# EAGLE schematic pimc (EAGLE 6.5.0)
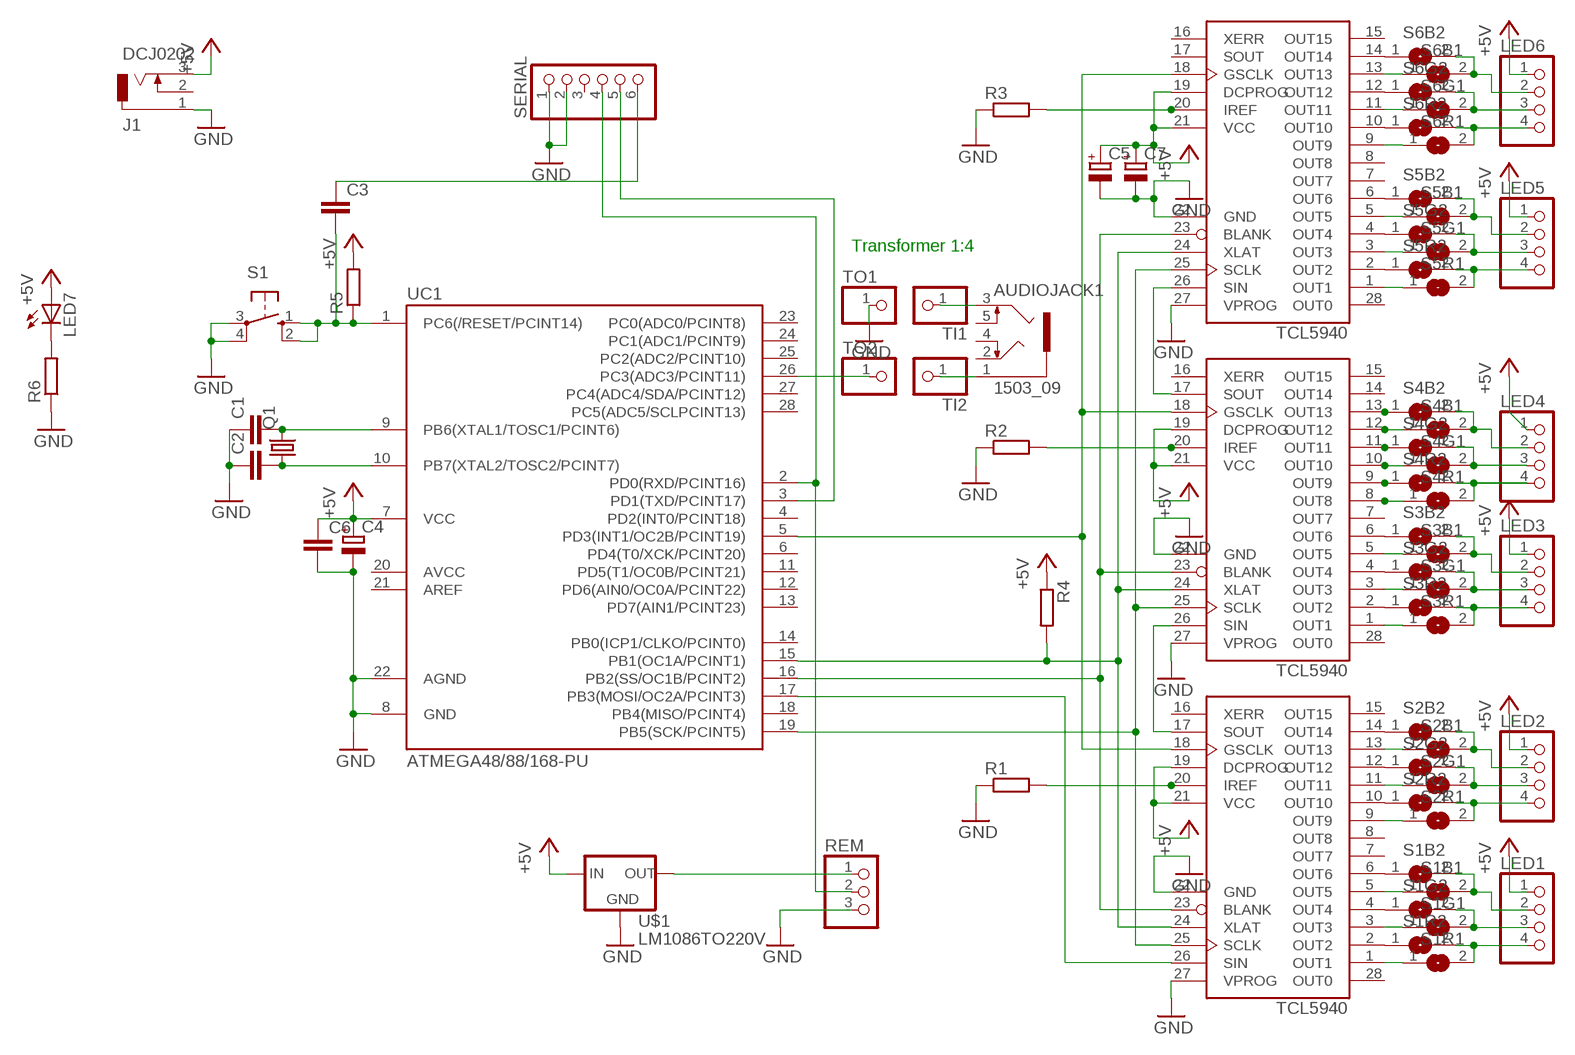
[diagram p0: schematic, sheet 1]

## Parts
AUDIOJACK1  1503_09  [1503_09]
C1  C-EU025-025X050  [C025-025X050]
C2  C-EU025-025X050  [C025-025X050]
C3  C-EU025-025X050  [C025-025X050]
C4  CPOL-EUE3.5-8  [E3,5-8]
C5  CPOL-EUE3.5-8  [E3,5-8]
C6  C-EU025-025X050  [C025-025X050]
C7  CPOL-EUE3.5-8  [E3,5-8]
DRV1  TCL5940  [DIP28]
DRV2  TCL5940  [DIP28]
DRV3  TCL5940  [DIP28]
J1  DCJ0202  [DCJ0202]
LED1  PINHD-1X4  [1X04]
LED2  PINHD-1X4  [1X04]
LED3  PINHD-1X4  [1X04]
LED4  PINHD-1X4  [1X04]
LED5  PINHD-1X4  [1X04]
LED6  PINHD-1X4  [1X04]
LED7  LED5MM  [LED5MM]
Q1  CRYSTALHC49S  [HC49/S]
R1  R-EU_0204/7  [0204/7]
R2  R-EU_0204/7  [0204/7]
R3  R-EU_0204/7  [0204/7]
R4  R-EU_0204/7  [0204/7]
R5  R-EU_0204/7  [0204/7]
R6  R-EU_0204/7  [0204/7]
REM  PINHD-1X3  [1X03]
S1  10-XX  [B3F-10XX]
S1B1  SJ  [SJ]
S1B2  SJ  [SJ]
S1G1  SJ  [SJ]
S1G2  SJ  [SJ]
S1R1  SJ  [SJ]
S1R2  SJ  [SJ]
S2B1  SJ  [SJ]
S2B2  SJ  [SJ]
S2G1  SJ  [SJ]
S2G2  SJ  [SJ]
S2R1  SJ  [SJ]
S2R2  SJ  [SJ]
S3B1  SJ  [SJ]
S3B2  SJ  [SJ]
S3G1  SJ  [SJ]
S3G2  SJ  [SJ]
S3R1  SJ  [SJ]
S3R2  SJ  [SJ]
S4B1  SJ  [SJ]
S4B2  SJ  [SJ]
S4G1  SJ  [SJ]
S4G2  SJ  [SJ]
S4R1  SJ  [SJ]
S4R2  SJ  [SJ]
S5B1  SJ  [SJ]
S5B2  SJ  [SJ]
S5G1  SJ  [SJ]
S5G2  SJ  [SJ]
S5R1  SJ  [SJ]
S5R2  SJ  [SJ]
S6B1  SJ  [SJ]
S6B2  SJ  [SJ]
S6G1  SJ  [SJ]
S6G2  SJ  [SJ]
S6R1  SJ  [SJ]
S6R2  SJ  [SJ]
SERIAL  PINHD-1X6  [1X06]
TI1  PINHD-1X1  [1X01]
TI2  PINHD-1X1  [1X01]
TO1  PINHD-1X1  [1X01]
TO2  PINHD-1X1  [1X01]
U$1  LM1086TO220V  [TO220S]
UC1  ATMEGA48/88/168-PU  [DIL28-3]

## Nets
+5V: C4.+ C5.+ C6.1 C7.+ DRV1.19(DCPROG) DRV1.21(VCC) DRV2.19(DCPROG) DRV2.21(VCC) DRV3.19(DCPROG) DRV3.21(VCC) J1.3 LED1.1 LED2.1 LED3.1 LED4.1 LED5.1 LED6.1 LED7.A R4.1 R5.2 U$1.3(IN) UC1.7(VCC)
GND: C1.1 C2.1 C4.- C5.- C6.2 C7.- DRV1.22(GND) DRV1.27(VPROG) DRV2.22(GND) DRV2.27(VPROG) DRV3.22(GND) DRV3.27(VPROG) J1.1 R1.1 R2.1 R3.1 R6.1 REM.3 S1.3(P) S1.4(P1) SERIAL.1 SERIAL.2 TO1.1 U$1.1(GND) UC1.8(GND) UC1.22(AGND)
N$1: DRV1.14(OUT14) S2B2.1
N$2: DRV1.12(OUT12) S2G2.1
N$3: DRV1.10(OUT10) S2R2.1
N$4: DRV1.2(OUT2) S1R2.1
N$5: DRV1.4(OUT4) S1G2.1
N$6: DRV1.6(OUT6) S1B2.1
N$7: DRV1.13(OUT13) S2B1.1
N$8: DRV1.11(OUT11) S2G1.1
N$9: DRV1.9(OUT9) S2R1.1
N$10: DRV1.5(OUT5) S1B1.1
N$11: DRV1.3(OUT3) S1G1.1
N$12: DRV1.1(OUT1) S1R1.1
N$13: LED2.2 S2B1.2 S2B2.2
N$14: LED2.3 S2G1.2 S2G2.2
N$15: LED2.4 S2R1.2 S2R2.2
N$16: LED1.2 S1B1.2 S1B2.2
N$17: LED1.3 S1G1.2 S1G2.2
N$18: LED1.4 S1R1.2 S1R2.2
N$19: DRV2.8(OUT8) S4R1.1
N$20: DRV2.10(OUT10) S4G1.1
N$21: DRV2.12(OUT12) S4B1.1
N$22: DRV2.5(OUT5) S3B1.1
N$23: DRV2.3(OUT3) S3G1.1
N$24: DRV2.1(OUT1) S3R1.1
N$25: LED4.4 S4R1.2 S4R2.2
N$26: LED4.3 S4G1.2 S4G2.2
N$27: LED4.2 S4B1.2 S4B2.2
N$28: LED3.2 S3B1.2 S3B2.2
N$29: LED3.3 S3G1.2 S3G2.2
N$30: LED3.4 S3R1.2 S3R2.2
N$31: DRV2.9(OUT9) S4R2.1
N$32: DRV2.11(OUT11) S4G2.1
N$33: DRV2.13(OUT13) S4B2.1
N$34: DRV2.2(OUT2) S3R2.1
N$35: DRV2.4(OUT4) S3G2.1
N$36: DRV2.6(OUT6) S3B2.1
N$37: DRV3.13(OUT13) S6B1.1
N$38: DRV3.11(OUT11) S6G1.1
N$39: DRV3.9(OUT9) S6R1.1
N$40: DRV3.5(OUT5) S5B1.1
N$41: DRV3.3(OUT3) S5G1.1
N$42: DRV3.1(OUT1) S5R1.1
N$43: LED6.2 S6B1.2 S6B2.2
N$44: LED6.3 S6G1.2 S6G2.2
N$45: LED6.4 S6R1.2 S6R2.2
N$46: LED5.2 S5B1.2 S5B2.2
N$47: LED5.3 S5G1.2 S5G2.2
N$48: LED5.4 S5R1.2 S5R2.2
N$49: DRV3.14(OUT14) S6B2.1
N$50: DRV3.12(OUT12) S6G2.1
N$51: DRV3.10(OUT10) S6R2.1
N$52: DRV3.2(OUT2) S5R2.1
N$53: DRV3.4(OUT4) S5G2.1
N$54: DRV3.6(OUT6) S5B2.1
N$55: DRV1.17(SOUT) DRV2.26(SIN)
N$56: DRV2.17(SOUT) DRV3.26(SIN)
N$57: DRV1.26(SIN) UC1.17(PB3(MOSI/OC2A/PCINT3))
N$58: DRV1.25(SCLK) DRV2.25(SCLK) DRV3.25(SCLK) UC1.19(PB5(SCK/PCINT5))
N$59: DRV1.24(XLAT) DRV2.24(XLAT) DRV3.24(XLAT) R4.2 UC1.15(PB1(OC1A/PCINT1))
N$60: DRV1.23(BLANK) DRV2.23(BLANK) DRV3.23(BLANK) UC1.16(PB2(SS/OC1B/PCINT2))
N$61: DRV3.20(IREF) R3.2
N$62: DRV2.20(IREF) R2.2
N$63: DRV1.20(IREF) R1.2
N$64: DRV1.18(GSCLK) DRV2.18(GSCLK) DRV3.18(GSCLK) UC1.5(PD3(INT1/OC2B/PCINT19))
N$65: C1.2 Q1.2 UC1.9(PB6(XTAL1/TOSC1/PCINT6))
N$66: C2.2 Q1.1 UC1.10(PB7(XTAL2/TOSC2/PCINT7))
N$67: AUDIOJACK1.1 TI2.1
N$68: AUDIOJACK1.3 TI1.1
N$69: LED7.K(C) R6.2
N$70: REM.2 SERIAL.4 UC1.2(PD0(RXD/PCINT16))
N$71: SERIAL.5 UC1.3(PD1(TXD/PCINT17))
N$72: C3.2 R5.1 S1.1(S) S1.2(S1) UC1.1(PC6(/RESET/PCINT14))
N$73: C3.1 SERIAL.6
N$74: REM.1 U$1.2(OUT)
N$75: TO2.1 UC1.26(PC3(ADC3/PCINT11))
Unconnected: AUDIOJACK1.2 AUDIOJACK1.4 AUDIOJACK1.5 DRV1.7(OUT7) DRV1.8(OUT8) DRV1.15(OUT15) DRV1.16(XERR) DRV1.28(OUT0) DRV2.7(OUT7) DRV2.14(OUT14) DRV2.15(OUT15) DRV2.16(XERR) DRV2.28(OUT0) DRV3.7(OUT7) DRV3.8(OUT8) DRV3.15(OUT15) DRV3.16(XERR) DRV3.17(SOUT) DRV3.28(OUT0) J1.2 SERIAL.3 UC1.4(PD2(INT0/PCINT18)) UC1.6(PD4(T0/XCK/PCINT20)) UC1.11(PD5(T1/OC0B/PCINT21)) UC1.12(PD6(AIN0/OC0A/PCINT22)) UC1.13(PD7(AIN1/PCINT23)) UC1.14(PB0(ICP1/CLKO/PCINT0)) UC1.18(PB4(MISO/PCINT4)) UC1.20(AVCC) UC1.21(AREF) UC1.23(PC0(ADC0/PCINT8)) UC1.24(PC1(ADC1/PCINT9)) UC1.25(PC2(ADC2/PCINT10)) UC1.27(PC4(ADC4/SDA/PCINT12)) UC1.28(PC5(ADC5/SCLPCINT13))

## Notes on the sheet
- Transformer 1:4

## Library data of the parts
AUDIOJACK1 = con-lumberg:1503_09: Jack connectors according to JISC 6560, 3.5 mm Klinkeneinbaukupplung nach JISC 6560, 3,5 mm, 3-polig/ stereo, abgewinkelte Ausführung, mit 2 Öffnern und Lötaugen, für Leiterplatten Rückseitenmontage Source: http://www.lumberg.com/Produkte/PDFs/1503_09.pdf; OC_FARNELL: 1243244; OC_NEWARK: unknown
C1-C3 C6 = rcl:C-EU: CAPACITOR, European symbol
C4 C5 C7 = rcl:CPOL-EU: POLARIZED CAPACITOR, European symbol
DRV1-DRV3 = tcl5940:TCL5940: 16-Channel 12-Bit LED Driver
J1 = con-jack:DCJ0202: DC POWER JACK Source: DCJ0202.pdf; OC_FARNELL: unknown; OC_NEWARK: unknown
LED1-LED6 = pinhead:PINHD-1X4: PIN HEADER
LED7 = led:LED: LED OSRAM: - CHIPLED LG R971, LG N971, LY N971, LG Q971, LY Q971, LO R971, LY R971 LH N974, LH R974 LS Q976, LO Q976, LY Q976 LO Q996 - Hyper CHIPLED LW Q18S LB Q993, LB Q99A, LB R99A - SideLED LS A670, LO A670, LY A670, LG A670, LP A670 LB A673, LV A673, LT A673, LW A673 LH A674 LY A675 LS A676, LA A676, LO A676, LY A676, LW A676 LS A679, LY A679, LG A679 - Hyper Micro SIDELED® LS Y876, LA Y876, LO Y876, LY Y876 LT Y87S - SmartLED LW L88C, LW L88S LB L89C, LB L89S, LG L890 LS L89K, LO L89K, LY L89K LS L896, LA L896, LO L896, LY L896 - TOPLED LS T670, LO T670, LY T670, LG T670, LP T670 LSG T670, LSP T670, LSY T670, LOP T670, LYG T670 LG T671, LOG T671, LSG T671 LB T673, LV T673, LT T673, LW T673 LH T674 LS T676, LA T676, LO T676, LY T676, LB T676, LH T676, LSB T676, LW T676 LB T67C, LV T67C, LT T67C, LS T67K, LO T67K, LY T67K, LW E67C LS E67B, LA E67B, LO E67B, LY E67B, LB E67C, LV E67C, LT E67C LW T67C LS T679, LY T679, LG T679 LS T770, LO T770, LY T770, LG T770, LP T770 LB T773, LV T773, LT T773, LW T773 LH T774 LS E675, LA E675, LY E675, LS T675 LS T776, LA T776, LO T776, LY T776, LB T776 LHGB T686 LT T68C, LB T68C - Hyper Mini TOPLED® LB M676 - Mini TOPLED Santana® LG M470 LS M47K, LO M47K, LY M47K Source: http://www.osram.convergy.de LUXEON: - LUMILED® LXK2-PW12-R00, LXK2-PW12-S00, LXK2-PW14-U00, LXK2-PW14-V00 LXK2-PM12-R00, LXK2-PM12-S00, LXK2-PM14-U00 LXK2-PE12-Q00, LXK2-PE12-R00, LXK2-PE12-S00, LXK2-PE14-T00, LXK2-PE14-U00 LXK2-PB12-K00, LXK2-PB12-L00, LXK2-PB12-M00, LXK2-PB14-N00, LXK2-PB14-P00, LXK2-PB14-Q00 LXK2-PR12-L00, LXK2-PR12-M00, LXK2-PR14-Q00, LXK2-PR14-R00 LXK2-PD12-Q00, LXK2-PD12-R00, LXK2-PD12-S00 LXK2-PH12-R00, LXK2-PH12-S00 LXK2-PL12-P00, LXK2-PL12-Q00, LXK2-PL12-R00 Source: www.luxeon.com KINGBRIGHT: KA-3528ASYC Source: www.kingbright.com
Q1 = crystal:CRYSTAL: CRYSTAL; OC_FARNELL: 1667008; OC_NEWARK: unknown
R1-R6 = rcl:R-EU_: RESISTOR, European symbol
REM = pinhead:PINHD-1X3: PIN HEADER
S1 = switch-omron:10-XX: OMRON SWITCH; MPN: B3F-1000; OC_FARNELL: 176432; OC_NEWARK: 36M3542
S1B1 S1B2 S1G1 S1G2 S1R1 S1R2 S2B1 S2B2 S2G1 S2G2 S2R1 S2R2 S3B1 S3B2 S3G1 S3G2 S3R1 S3R2 S4B1 S4B2 S4G1 S4G2 S4R1 S4R2 S5B1 S5B2 S5G1 S5G2 S5R1 S5R2 S6B1 S6B2 S6G1 S6G2 S6R1 S6R2 = jumper:SJ: SMD solder JUMPER
SERIAL = pinhead:PINHD-1X6: PIN HEADER
TI1 TI2 TO1 TO2 = pinhead:PINHD-1X1: PIN HEADER
U$1 = v-reg-2:LM1086
UC1 = atmega8:ATMEGA48/88/168-PU